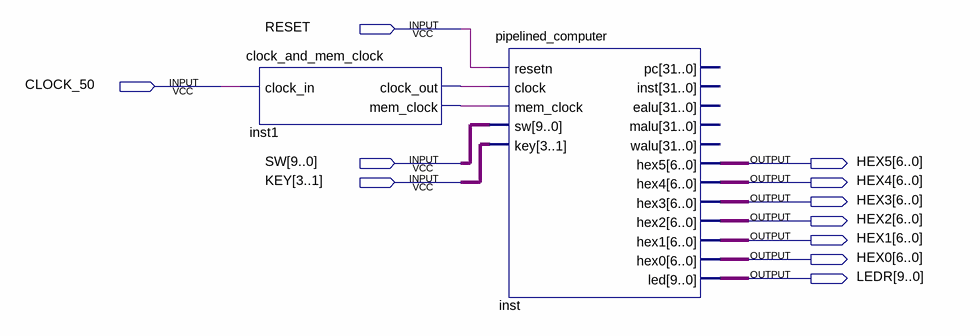
[diagram p0: schematic sheet]
// Quartus schematic pipe_computer2.bdf as structural Verilog: 2 symbols, 11 pins
module pipe_computer2 (
  input  RESET,
  input  CLOCK_50,
  input  [9:0] SW,
  input  [3:1] KEY,
  output [6:0] HEX5,
  output [6:0] HEX4,
  output [6:0] HEX3,
  output [6:0] HEX2,
  output [6:0] HEX1,
  output [6:0] HEX0,
  output [9:0] LEDR
);

  wire inst1_clock_out, inst1_mem_clock;

  clock_and_mem_clock inst1 (.clock_in(CLOCK_50), .clock_out(inst1_clock_out), .mem_clock(inst1_mem_clock));
  pipelined_computer inst (
    .resetn(RESET), .clock(inst1_clock_out), .mem_clock(inst1_mem_clock), .sw(SW), .key(KEY), .hex5(HEX5),
    .hex4(HEX4), .hex3(HEX3), .hex2(HEX2), .hex1(HEX1), .hex0(HEX0), .led(LEDR));  // open: pc, inst, ealu, malu, walu
endmodule
